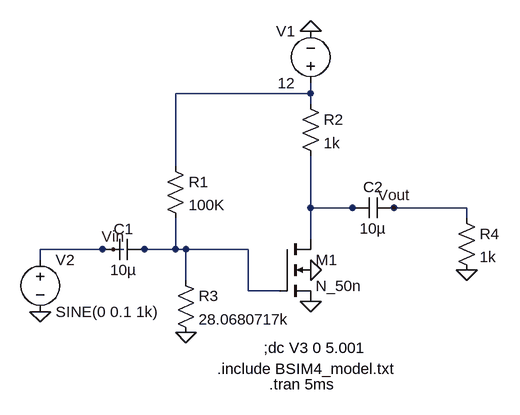
[diagram p0: schematic Lab_5_Vth_calc.asc]
Lab_5_Vth_calc.asc, the LTspice schematic file:
Version 4
SHEET 1 880 680
WIRE 384 -16 384 -32
WIRE 384 -16 176 -16
WIRE 384 0 384 -16
WIRE 176 96 176 -16
WIRE 384 160 384 80
WIRE 448 160 384 160
WIRE 464 160 448 160
WIRE 512 160 496 160
WIRE 624 160 512 160
WIRE 624 176 624 160
WIRE 384 208 384 160
WIRE 64 224 -32 224
WIRE 80 224 64 224
WIRE 96 224 80 224
WIRE 128 224 112 224
WIRE 176 224 176 176
WIRE 176 224 128 224
WIRE 192 224 176 224
WIRE 288 224 192 224
WIRE -32 240 -32 224
WIRE 192 272 192 224
WIRE 288 288 288 224
WIRE 336 288 288 288
FLAG 192 352 0
FLAG 384 304 0
FLAG 80 224 Vin
FLAG 512 160 Vout
FLAG -32 320 0
FLAG 624 256 0
FLAG 384 -112 0
FLAG 384 256 0
SYMBOL res 160 80 R0
SYMATTR InstName R1
SYMATTR Value 100K
SYMBOL res 176 256 R0
SYMATTR InstName R3
SYMATTR Value 28.0680717k
SYMBOL cap 512 144 R90
WINDOW 0 0 32 VBottom 2
WINDOW 3 32 32 VTop 2
SYMATTR InstName C2
SYMATTR Value 10µ
SYMBOL voltage -32 224 R0
WINDOW 123 0 0 Left 0
WINDOW 39 0 0 Left 0
SYMATTR InstName V2
SYMATTR Value SINE(0 0.1 1k)
SYMBOL res 608 160 R0
SYMATTR InstName R4
SYMATTR Value 1k
SYMBOL voltage 384 -16 R180
WINDOW 0 24 96 Left 2
WINDOW 3 24 16 Left 2
WINDOW 123 0 0 Left 0
WINDOW 39 0 0 Left 0
SYMATTR InstName V1
SYMATTR Value 12
SYMBOL res 368 -16 R0
SYMATTR InstName R2
SYMATTR Value 1k
SYMBOL cap 128 208 R90
WINDOW 0 0 32 VBottom 2
WINDOW 3 32 32 VTop 2
SYMATTR InstName C1
SYMATTR Value 10µ
SYMBOL nmos4 336 208 R0
SYMATTR InstName M1
SYMATTR Value N_50n
SYMATTR Value2 l=50n w=500n
TEXT 312 376 Left 2 !;dc V3 0 5.001
TEXT 320 432 Left 2 !.tran 5ms
TEXT 240 408 Left 2 !.include BSIM4_model.txt

The netlist it stands for:
* Lab_5_Vth_calc.asc
R1 N001 N003 100K
R3 N003 0 28.0680717k
C2 Vout N002 10µ
V2 Vin 0 SINE(0 0.1 1k)
R4 Vout 0 1k
V1 N001 0 12
R2 N001 N002 1k
C1 N003 Vin 10µ
M1 N002 N003 0 0 N_50n l=50n w=500n
.model NMOS NMOS
.model PMOS PMOS
.lib standard.mos
;dc V3 0 5.001
.tran 5ms
.include BSIM4_model.txt
.backanno
.end